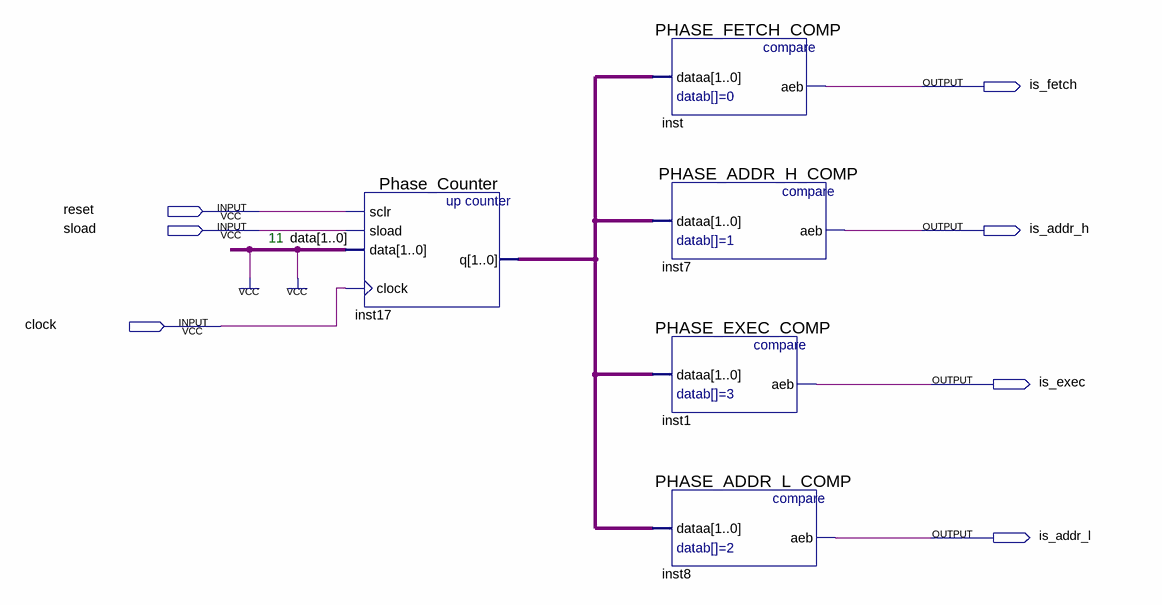
[diagram p0: schematic sheet]
// Quartus schematic phase_counter_unit.bdf as structural Verilog: 5 symbols, 7 pins
module phase_counter_unit (
  input  reset,
  input  sload,
  input  clock,
  output is_fetch,
  output is_addr_h,
  output is_exec,
  output is_addr_l
);

  wire [1:0] inst17_q;

  Phase_Counter inst17 (.sclr(reset), .sload(sload), .data(2'b11), .clock(clock), .q(inst17_q));
  PHASE_FETCH_COMP inst (.dataa(inst17_q), .aeb(is_fetch));
  PHASE_ADDR_H_COMP inst7 (.dataa(inst17_q), .aeb(is_addr_h));
  PHASE_EXEC_COMP inst1 (.dataa(inst17_q), .aeb(is_exec));
  PHASE_ADDR_L_COMP inst8 (.dataa(inst17_q), .aeb(is_addr_l));

  // Notes on the sheet:
  //   11
endmodule
